# Altium schematic sheet Mainboard.SchDoc
size Letter; SheetNumber: 1; SheetTotal: 1; SPICEModelCacheOOHNOLTT: <root> / <DocumentId>OOHNOLTT</DocumentId> / </root>
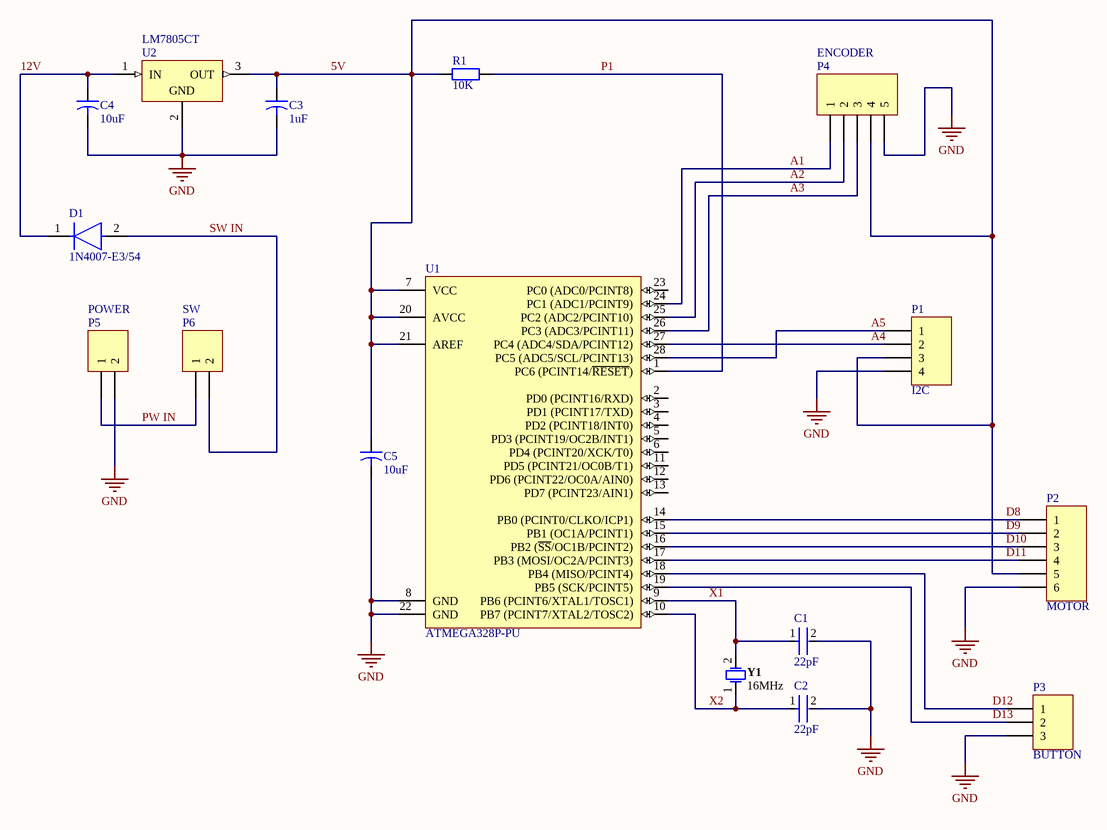
[diagram p0: Mainboard.SchDoc]

## Parts
C1  22pF  [FP-RCE0DB-MFG]
C2  22pF  [FP-RCE0DB-MFG]
C3  1uF  [CAPR5-4X5]
C4  10uF  [CAPR5-4X5]
C5  10uF  [CAPR5-4X5]
D1  1N4007-E3/54  [FP-1N4007-MFG]
P1  I2C  [HDR1X4]
P2  MOTOR  [HDR1X6]
P3  BUTTON  [HDR1X3]
P4  ENCODER  [HDR1X5]
P5  POWER  [HDR1X2]
P6  SW  [HDR1X2]
R1  10K  [AXIAL-0.4]
U1  ATMEGA328P-PU  [ATML-28P3]
U2  LM7805CT  [FAIR-TO-220-3]
Y1  16MHz  [FOX-FOXSLF160-20]

## Nets
GND: C1.2 C2.2 C3.2 C4.2 C5.2 P1.4 P2.6 P3.3 P4.5 P5.2 U1.8(GND) U1.22(GND) U2.2(GND)
5V: C3.1 C5.1 P1.3 P2.5 P4.4 R1.1 U1.7(VCC) U1.20(AVCC) U1.21(AREF) U2.3(OUT)
12V: C4.1 D1.1(C) U2.1(IN)
A1: P4.1 U1.24(PC1_(ADC1/PCINT9))
A2: P4.2 U1.25(PC2_(ADC2/PCINT10))
A3: P4.3 U1.26(PC3_(ADC3/PCINT11))
A4: P1.2 U1.27(PC4_(ADC4/SDA/PCINT12))
A5: P1.1 U1.28(PC5_(ADC5/SCL/PCINT13))
D8: P2.1 U1.14(PB0_(PCINT0/CLKO/ICP1))
D9: P2.2 U1.15(PB1_(OC1A/PCINT1))
D10: P2.3 U1.16(PB2_(~{SS}/OC1B/PCINT2))
D11: P2.4 U1.17(PB3_(MOSI/OC2A/PCINT3))
D12: P3.1 U1.18(PB4_(MISO/PCINT4))
D13: P3.2 U1.19(PB5_(SCK/PCINT5))
P1: R1.2 U1.1(PC6_(PCINT14/~{RESET}))
PW IN: P5.1 P6.1
SW IN: D1.2(A) P6.2
X1: C1.1 U1.9(PB6_(PCINT6/XTAL1/TOSC1)) Y1.2
X2: C2.1 U1.10(PB7_(PCINT7/XTAL2/TOSC2)) Y1.1

Not connected (* = marked no-connect by the designer): U1 2(PD0_(PCINT16/RXD)) 3(PD1_(PCINT17/TXD)) 4(PD2_(PCINT18/INT0)) 5(PD3_(PCINT19/OC2B/INT1)) 6(PD4_(PCINT20/XCK/T0)) 11(PD5_(PCINT21/OC0B/T1)) 12(PD6_(PCINT22/OC0A/AIN0)) 13(PD7_(PCINT23/AIN1)) 23(PC0_(ADC0/PCINT8))

## Library data of the parts
C1 C2 = CMP-06035-057691-1: Cap Ceramic 22pF 50V C0G ±5% Radial 2.5mm +125°C Ammo Pack; Lead Diameter: 0.5mm; Lead/Base Style: Straight; Termination: Radial; Height - Seated (Max): 0.138inch; Capacitance: 22pF; Height: 3.5mm; Dielectric: C0G; Voltage Rating (DC): 50V; Tolerance: 5%; Package Quantity: 2000; Max Operating Temperature: 125°C; Min Operating Temperature: -55°C; Packaging: Tape and Reel; Lead Pitch: 0.098inch; Mount: Through Hole; Length: 0.142inch; Voltage Rating: 50V; Resistor Type: Ceramic; Ratings: AEC-Q200; Case/Package: Radial; Width: 0.098inch
C3-C5 = Cap2: Capacitor; Published: 23-Sep-2002; PackageReference: CAPR5-4X5; Publisher: Altium Limited; PackageDescription: Capacitor; 2 Leads
  C3: Value: 1uF
  C4 C5: Value: 10uF
D1 = CMP-02540-000046-1: DIODE GEN PURP 1KV 1A DO204AL; Manufacturer: Vishay; Value: 15pF; Max Junction Temp: +150°C; Max Surge Forward Current: 30A; Max Repetitive Reverse Voltage: 1000V; Peak Reverse Current: 30uA; Octopart: https://octopart.com/1n4007-e3%2F54-vishay-39548207; Digikey Description: DIODE GEN PURP 1KV 1A DO204AL; Category: Diode; Mouser Description: Rectifiers Vr/1000V Io/1A; Automotive: No; Package: 1N4007; Device Class L3: Rectifier Diodes; Temperature Range High: +150°C; Capacitance: 15pF; Ipc Land Pattern Name: DIOPA1088W105L520D270; Lead Free: Yes; ComponentLink2Description: Datasheet; Forward Current: 1A; Device Class L1: Discrete Semiconductors; ComponentLink2URL: http://www.vishay.com/docs/88503/1n4001.pdf; Temperature Range Low: -50°C; Height: 2.7mm; RoHS: TRUE; Temperature: -50°C to +150°C; Device Class L2: Diodes; Manufacturer Part Number: 1N4007-E3/54
P1 = Header 4: Header, 4-Pin; LatestRevisionDate: 17-Jul-2002; LatestRevisionNote: Re-released for DXP Platform.; Publisher: Altium Limited
P2 = Header 6: Header, 6-Pin; LatestRevisionDate: 17-Jul-2002; LatestRevisionNote: Re-released for DXP Platform.; Publisher: Altium Limited
P3 = Header 3: Header, 3-Pin; LatestRevisionDate: 17-Jul-2002; LatestRevisionNote: Re-released for DXP Platform.; Publisher: Altium Limited
P4 = Header 5: Header, 5-Pin; LatestRevisionDate: 17-Jul-2002; LatestRevisionNote: Re-released for DXP Platform.; Publisher: Altium Limited
P5 P6 = Header 2: Header, 2-Pin; LatestRevisionDate: 17-Jul-2002; LatestRevisionNote: Re-released for DXP Platform.; Publisher: Altium Limited
R1 = Res2: Resistor; Published: 8-Jun-2000; LatestRevisionDate: 17-Jul-2002; LatestRevisionNote: Re-released for DXP Platform.; PackageReference: AXIAL-0.4; Publisher: Altium Limited; PackageDescription: Axial Device, Thru-Hole; 2 Leads; 0.4 in Pin Spacing; Value: 10K
U1 = CMP-020-00004-3: 8-Bit Microcontroller with 32 KBytes In-System Programmable Flash, 23 I/Os, -40 to 85 degC, 28-Pin PDIP (28P3), RoHS, Tube; Manufacturer: Atmel; I/Os: 23; Density: 32KB; Package Version: Rev. B, 09/2001; Max Clock Frequency: 20MHz; Interface: USART; Max Supply Voltage: 5.5V; Min Supply Voltage: 1.8V; Ethernet Channels: 0; RAM Size: 2KB; RoHS Compliant: True; Datasheet URL: http://www.atmel.com/images/Atmel-8271-8-bit-AVR-Microcontroller-ATmega48A-48PA-88A-88PA-168A-168PA-328-328P_datasheet_Complete.pdf; Packaging: Rail/Tube; Manufacturer URL: http://www.atmel.com/; Mounting Technology: TH; Package URL: http://www.atmel.com/images/Atmel-8271-8-bit-AVR-Microcontroller-ATmega48A-48PA-88A-88PA-168A-168PA-328-328P_datasheet_Complete.pdf; Datasheet Version: Rev. 8271J, 11/2015; Package Description: 28-Pin Plastic Dual Inline Package, Body 34.671 x 7.3025 mm, Pitch 2.54 mm; Package Quantity: 14; Min Operating Temperature: -40°C; Max Operating Temperature: 85°C; Case/Package: DIP; Pins: 28; Package Reference: 28P3
U2 = CMP-2000-04938-1: Positive Voltage Regulator, 5 V, 1 A, -40 to 125 degC, 3-Pin TO-220, RoHS, Tube; Manufacturer: FairchildSemiconductor; Maximum Input Voltage: 35V; Maximum Quiescent Current: 8mA; Load Regulation: 100mV; Maximum Output Current: 2.2(Typ)A; Output Type: Fixed; Typical Dropout Voltage @ Current: 2@1AV; Rad Hard: No; Output Voltage: 5V; Accuracy: ±4%; Number of Outputs: 1; Category: LinearRegulator; Package Description: 3-Pin Through Hole Device, Body 10 x 4.5 mm, Pitch 2.54 mm; Packaging: Rail/Tube; Mounting: ThroughHole; Polarity: Positive; Manufacturer URL: https://www.fairchildsemi.com/; Line Regulation: 100mV; Datasheet Version: Aug-12; Datasheet URL: https://datasheet.ciiva.com/26904/lm7805ct-26904988.pdf; Package Reference: TO-220; Package URL: https://www.fairchildsemi.com/package-drawings/TO/TO220B03.pdf; Package: 3TO-220AB; Operating Temperature: -40to125degC; Type: Linear
Y1 = CMP-1749-00003-1: Resistance Weld Thru-Hole Crystal, 16 MHz, -20 to 70 degC, 2-Pin THD, RoHS, Bulk; Voltage Rating: 250 V; Tolerance: 1%; Resistance: 221 kohm; Case\Package: Axial; Power Rating: 250 mW; RoHSCompliant: true; Package Quantity: 200; Packaging: Bulk; Min Operating Temperature: -55 degC; DatasheetVersion: Mar-15; ComponentLink1URL: http://www.foxonline.com/; Max Operating Temperature: 155 degC; PackageReference: FOXSLF160-20; Mount: Through Hole; PackageDescription: 2-Pin Through Hole Device, Body 11.35 x 4.65 mm; ComponentLink1Description: Manufacturer URL; ComponentLink2URL: http://www.foxonline.com/pdfs/hc49slf.pdf; ComponentLink2Description: Datasheet; Length: 0.248 inch